# EAGLE design Beton Ajek NO AUTOROUTE (EAGLE 9.6.2)
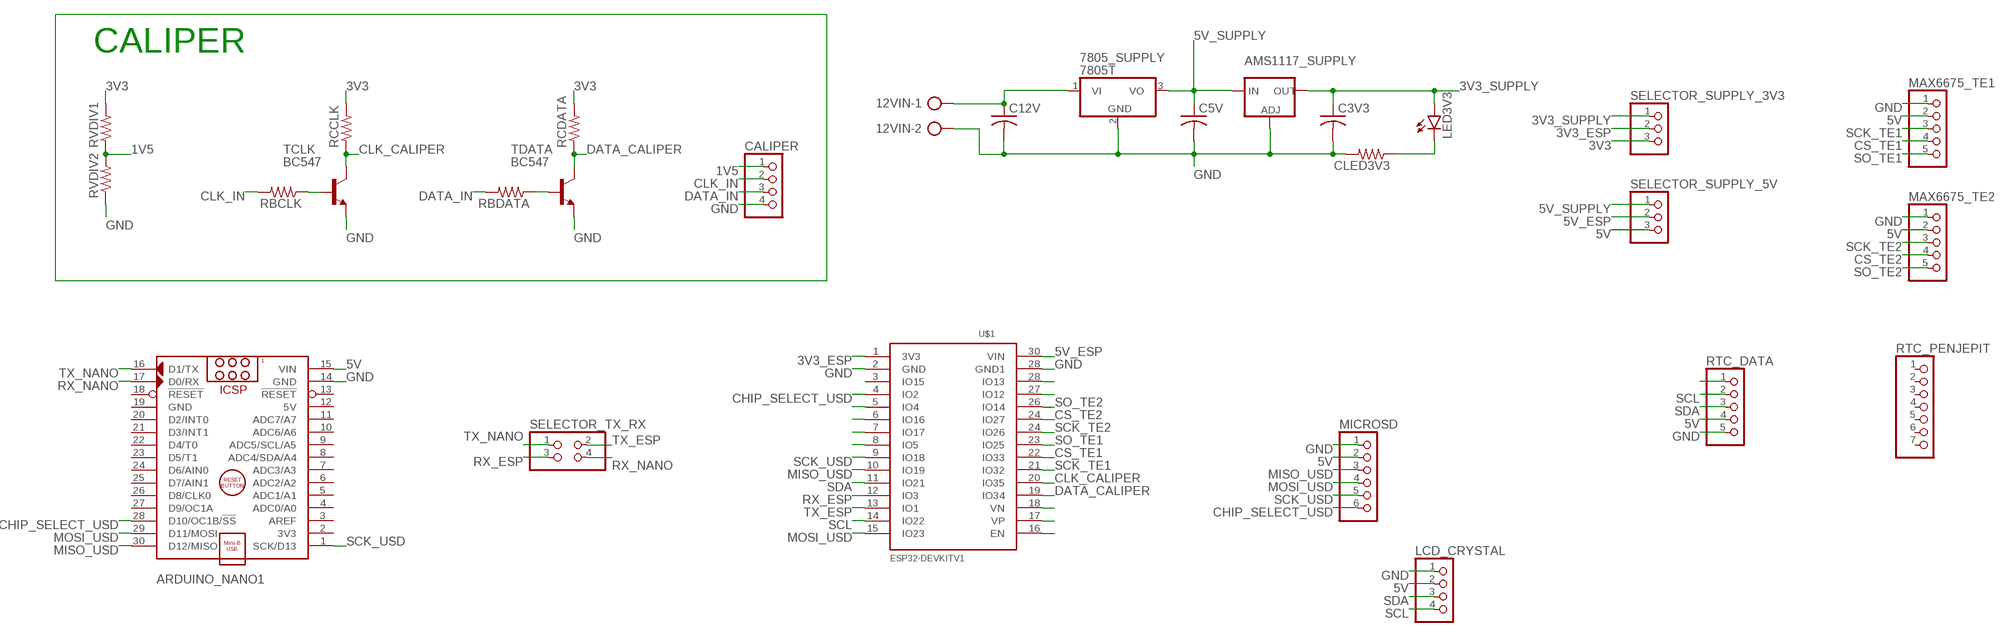
[diagram p0: schematic, sheet 1]

## Parts
12VIN  AK300/2  [AK300/2]
7805_SUPPLY  7805T  [TO220H]
AMS1117_SUPPLY  V_REG_LM1117SOT223  [SOT223]
ARDUINO_NANO1  ARDUINO_NANO  [ARDUINO_NANO]
C3V3  C-US075-032X103  [C075-032X103]
C5V  C-US075-032X103  [C075-032X103]
C12V  C-US075-032X103  [C075-032X103]
CALIPER  PINHD-1X4  [1X04]
CLED3V3  R-US_0207/10  [0207/10]
LCD_CRYSTAL  PINHD-1X4  [1X04]
LED3V3  LED5MM  [LED5MM]
MAX6675_TE1  PINHD-1X5  [1X05]
MAX6675_TE2  PINHD-1X5  [1X05]
MICROSD  PINHD-1X6  [1X06]
RBCLK  R-US_0207/10  [0207/10]
RBDATA  R-US_0207/10  [0207/10]
RCCLK  R-US_0207/10  [0207/10]
RCDATA  R-US_0207/10  [0207/10]
RTC_DATA  PINHD-1X5  [1X05]
RTC_PENJEPIT  PINHD-1X7  [1X07]
RVDIV1  R-US_0207/10  [0207/10]
RVDIV2  R-US_0207/10  [0207/10]
SELECTOR_SUPPLY_3V3  PINHD-1X3  [1X03]
SELECTOR_SUPPLY_5V  PINHD-1X3  [1X03]
SELECTOR_TX_RX  PINHD-2X2  [2X02]
TCLK  BC547  [TO92]
TDATA  BC547  [TO92]
U$1  ESP32DEVKITV1  [ESP32-DEVKITV1]

## Nets
1V5: CALIPER.1 RVDIV1.1 RVDIV2.2
3V3: RCCLK.2 RCDATA.2 RVDIV1.2 SELECTOR_SUPPLY_3V3.3
3V3_ESP: SELECTOR_SUPPLY_3V3.2 U$1.1(3V3)
3V3_SUPPLY: AMS1117_SUPPLY.2(OUT) AMS1117_SUPPLY.4(OUT) C3V3.1 LED3V3.A SELECTOR_SUPPLY_3V3.1
5V: ARDUINO_NANO1.15(VIN) LCD_CRYSTAL.2 MAX6675_TE1.2 MAX6675_TE2.2 MICROSD.2 RTC_DATA.4 SELECTOR_SUPPLY_5V.3
5V_ESP: SELECTOR_SUPPLY_5V.2 U$1.30(VIN)
5V_SUPPLY: 7805_SUPPLY.3(VO) AMS1117_SUPPLY.3(IN) C5V.1 SELECTOR_SUPPLY_5V.1
CHIP_SELECT_USD: ARDUINO_NANO1.28(D10/OC1B/!SS) MICROSD.6 U$1.4(IO2)
CLK_CALIPER: RCCLK.1 TCLK.3(C) U$1.20(IO35)
CLK_IN: CALIPER.2 RBCLK.2
CS_TE1: MAX6675_TE1.4 U$1.22(IO33)
CS_TE2: MAX6675_TE2.4 U$1.24(IO27)
DATA_CALIPER: RCDATA.1 TDATA.3(C) U$1.19(IO34)
DATA_IN: CALIPER.3 RBDATA.2
GND: 12VIN.2 7805_SUPPLY.2(GND) AMS1117_SUPPLY.1(ADJ) ARDUINO_NANO1.14(GND) C3V3.2 C5V.2 C12V.2 CALIPER.4 CLED3V3.2 LCD_CRYSTAL.1 MAX6675_TE1.1 MAX6675_TE2.1 MICROSD.1 RTC_DATA.5 RVDIV2.1 TCLK.1(E) TDATA.1(E) U$1.2(GND) U$1.28(GND1)
MISO_USD: ARDUINO_NANO1.30(D12/MISO) MICROSD.3 U$1.10(IO19)
MOSI_USD: ARDUINO_NANO1.29(D11/MOSI) MICROSD.4 U$1.15(IO23)
N$1: 12VIN.1 7805_SUPPLY.1(VI) C12V.1
N$2: RBCLK.1 TCLK.2(B)
N$4: U$1.28(IO13)
N$5: U$1.27(IO12)
N$6: U$1.5(IO4)
N$13: CLED3V3.1 LED3V3.K(C)
N$14: U$1.18(VN)
N$15: U$1.17(VP)
N$16: U$1.16(EN)
N$18: RBDATA.1 TDATA.2(B)
N$22: U$1.6(IO16)
N$23: U$1.7(IO17)
N$24: U$1.8(IO5)
N$52: RTC_DATA.1
RX_ESP: SELECTOR_TX_RX.3 U$1.12(IO3)
RX_NANO: ARDUINO_NANO1.17(D0/RX) SELECTOR_TX_RX.4
SCK_TE1: MAX6675_TE1.3 U$1.21(IO32)
SCK_TE2: MAX6675_TE2.3 U$1.24(IO26)
SCK_USD: ARDUINO_NANO1.1(SCK/D13) MICROSD.5 U$1.9(IO18)
SCL: LCD_CRYSTAL.4 RTC_DATA.2 U$1.14(IO22)
SDA: LCD_CRYSTAL.3 RTC_DATA.3 U$1.11(IO21)
SO_TE1: MAX6675_TE1.5 U$1.23(IO25)
SO_TE2: MAX6675_TE2.5 U$1.26(IO14)
TX_ESP: SELECTOR_TX_RX.2 U$1.13(IO1)
TX_NANO: ARDUINO_NANO1.16(D1/TX) SELECTOR_TX_RX.1
Unconnected: ARDUINO_NANO1.2(3V3) ARDUINO_NANO1.3(AREF) ARDUINO_NANO1.4(ADC0/A0) ARDUINO_NANO1.5(ADC1/A1) ARDUINO_NANO1.6(ADC2/A2) ARDUINO_NANO1.7(ADC3/A3) ARDUINO_NANO1.8(ADC4/SDA/A4) ARDUINO_NANO1.9(ADC5/SCL/A5) ARDUINO_NANO1.10(ADC6/A6) ARDUINO_NANO1.11(ADC7/A7) ARDUINO_NANO1.13(!RESET) ARDUINO_NANO1.18(!RESET) ARDUINO_NANO1.20(D2/INT0) ARDUINO_NANO1.21(D3/INT1) ARDUINO_NANO1.22(D4/T0) ARDUINO_NANO1.23(D5/T1) ARDUINO_NANO1.24(D6/AIN0) ARDUINO_NANO1.25(D7/AIN1) ARDUINO_NANO1.26(D8/CLK0) ARDUINO_NANO1.27(D9/OC1A) RTC_PENJEPIT.1 RTC_PENJEPIT.2 RTC_PENJEPIT.3 RTC_PENJEPIT.4 RTC_PENJEPIT.5 RTC_PENJEPIT.6 RTC_PENJEPIT.7 U$1.3(IO15)

## Notes on the sheet
- CALIPER

## Power pins joined to a net without a drawn wire
5V: ARDUINO_NANO1.12(5V)
GND: ARDUINO_NANO1.19(GND)

## Library data of the parts
12VIN = con-ptr500:AK300/2: CONNECTOR
7805_SUPPLY = adafruit:78*: Positive VOLTAGE REGULATOR Added bigger pads to the TO-92 package
AMS1117_SUPPLY = SparkFun-IC-Power:V_REG_LM1117: Voltage Regulator LM1117 Standard adjustable voltage regulator but in SMD form. Spark Fun Electronics SKU : COM-00595; PROD_ID: VREG-08170
ARDUINO_NANO1 = ArduinoNanoV30:ARDUINO_NANO: Arduino Nano V3.0 Module Overview: The Arduino Nano is a small, complete, and breadboard-friendly board based on the ATmega328 (Arduino Nano 3.x) or ATmega168 (Arduino Nano 2.x). It has more or less the same functionality of the Arduino Duemilanove, but in a different package. It lacks only a DC power jack, and works with a Mini-B USB cable instead of a standard one. The Nano was designed and is being produced by Gravitech <http://www.gravitech.us/arna30wiatp.html>. General specifications: Item Value Microcontroller Atmel ATmega168 or ATmega328 Operating Voltage (logic level) 5 V Input Voltage (recommended) 7-12 V Input Voltage (limits) 6-20 V Digital I/O Pins 14 (of which 6 provide PWM output) Analog Input Pins 8 DC Current per I/O Pin 40 mA Flash Memory 16 KB (ATmega168) or 32 KB (ATmega328) of which 2 KB used by bootloader SRAM 1 KB (ATmega168) or 2 KB (ATmega328) EEPROM 512 bytes (ATmega168) or 1 KB (ATmega328) Clock Speed 16 MHz Dimensions (Inches) 0.73" x 1.70" Dimensions (mm) 18mm x 45mm Overall height About 9 mm (not including pins) Weigth 5 g Power: The Arduino Nano can be powered via the Mini-B USB connection, 6-20V unregulated external power supply (pin 30), or 5V regulated external power supply (pin 27). The power source is automatically selected to the highest voltage source. Memory: The ATmega168 has 16 KB of flash memory for storing code (of which 2 KB is used for the bootloader); the ATmega328 has 32 KB, (also with 2 KB used for the bootloader). The ATmega168 has 1 KB of SRAM and 512 bytes of EEPROM (which can be read and written with the EEPROM library); the ATmega328 has 2 KB of SRAM and 1 KB of EEPROM. Input and Output: Each of the 14 digital pins on the Nano can be used as an input or output, using pinMode(), digitalWrite(), and digitalRead() functions. They operate at 5 volts. Each pin can provide or receive a maximum of 40 mA and has an internal pull-up resistor (disconnected by default) of 20-50 kOhms. In addition, some pins have specialized functions. Visit Arduino - ArduinoBoardNano <https://www.arduino.cc/en/Main/ArduinoBoardNano>
C3V3 C5V C12V = rcl:C-US: CAPACITOR, American symbol; SPICEPREFIX: C
CALIPER LCD_CRYSTAL = pinhead:PINHD-1X4: PIN HEADER
CLED3V3 RBCLK RBDATA RCCLK RCDATA RVDIV1 RVDIV2 = rcl:R-US_: RESISTOR, American symbol; SPICEPREFIX: R
LED3V3 = led:LED: LED OSRAM: - CHIPLED LG R971, LG N971, LY N971, LG Q971, LY Q971, LO R971, LY R971 LH N974, LH R974 LS Q976, LO Q976, LY Q976 LO Q996 - Hyper CHIPLED LW Q18S LB Q993, LB Q99A, LB R99A - SideLED LS A670, LO A670, LY A670, LG A670, LP A670 LB A673, LV A673, LT A673, LW A673 LH A674 LY A675 LS A676, LA A676, LO A676, LY A676, LW A676 LS A679, LY A679, LG A679 - Hyper Micro SIDELED® LS Y876, LA Y876, LO Y876, LY Y876 LT Y87S - SmartLED LW L88C, LW L88S LB L89C, LB L89S, LG L890 LS L89K, LO L89K, LY L89K LS L896, LA L896, LO L896, LY L896 - TOPLED LS T670, LO T670, LY T670, LG T670, LP T670 LSG T670, LSP T670, LSY T670, LOP T670, LYG T670 LG T671, LOG T671, LSG T671 LB T673, LV T673, LT T673, LW T673 LH T674 LS T676, LA T676, LO T676, LY T676, LB T676, LH T676, LSB T676, LW T676 LB T67C, LV T67C, LT T67C, LS T67K, LO T67K, LY T67K, LW E67C LS E67B, LA E67B, LO E67B, LY E67B, LB E67C, LV E67C, LT E67C LW T67C LS T679, LY T679, LG T679 LS T770, LO T770, LY T770, LG T770, LP T770 LB T773, LV T773, LT T773, LW T773 LH T774 LS E675, LA E675, LY E675, LS T675 LS T776, LA T776, LO T776, LY T776, LB T776 LHGB T686 LT T68C, LB T68C - Hyper Mini TOPLED® LB M676 - Mini TOPLED Santana® LG M470 LS M47K, LO M47K, LY M47K Source: http://www.osram.convergy.de LUXEON: - LUMILED® LXK2-PW12-R00, LXK2-PW12-S00, LXK2-PW14-U00, LXK2-PW14-V00 LXK2-PM12-R00, LXK2-PM12-S00, LXK2-PM14-U00 LXK2-PE12-Q00, LXK2-PE12-R00, LXK2-PE12-S00, LXK2-PE14-T00, LXK2-PE14-U00 LXK2-PB12-K00, LXK2-PB12-L00, LXK2-PB12-M00, LXK2-PB14-N00, LXK2-PB14-P00, LXK2-PB14-Q00 LXK2-PR12-L00, LXK2-PR12-M00, LXK2-PR14-Q00, LXK2-PR14-R00 LXK2-PD12-Q00, LXK2-PD12-R00, LXK2-PD12-S00 LXK2-PH12-R00, LXK2-PH12-S00 LXK2-PL12-P00, LXK2-PL12-Q00, LXK2-PL12-R00 Source: www.luxeon.com KINGBRIGHT: KA-3528ASYC Source: www.kingbright.com
MAX6675_TE1 MAX6675_TE2 RTC_DATA = pinhead:PINHD-1X5: PIN HEADER
MICROSD = pinhead:PINHD-1X6: PIN HEADER
RTC_PENJEPIT = pinhead:PINHD-1X7: PIN HEADER
SELECTOR_SUPPLY_3V3 SELECTOR_SUPPLY_5V = pinhead:PINHD-1X3: PIN HEADER
SELECTOR_TX_RX = pinhead:PINHD-2X2: PIN HEADER
TCLK TDATA = transistor:BC547: NPN TRANSISTOR
U$1 = ESP32-DEVKITV1:ESP32DEVKITV1

## Board
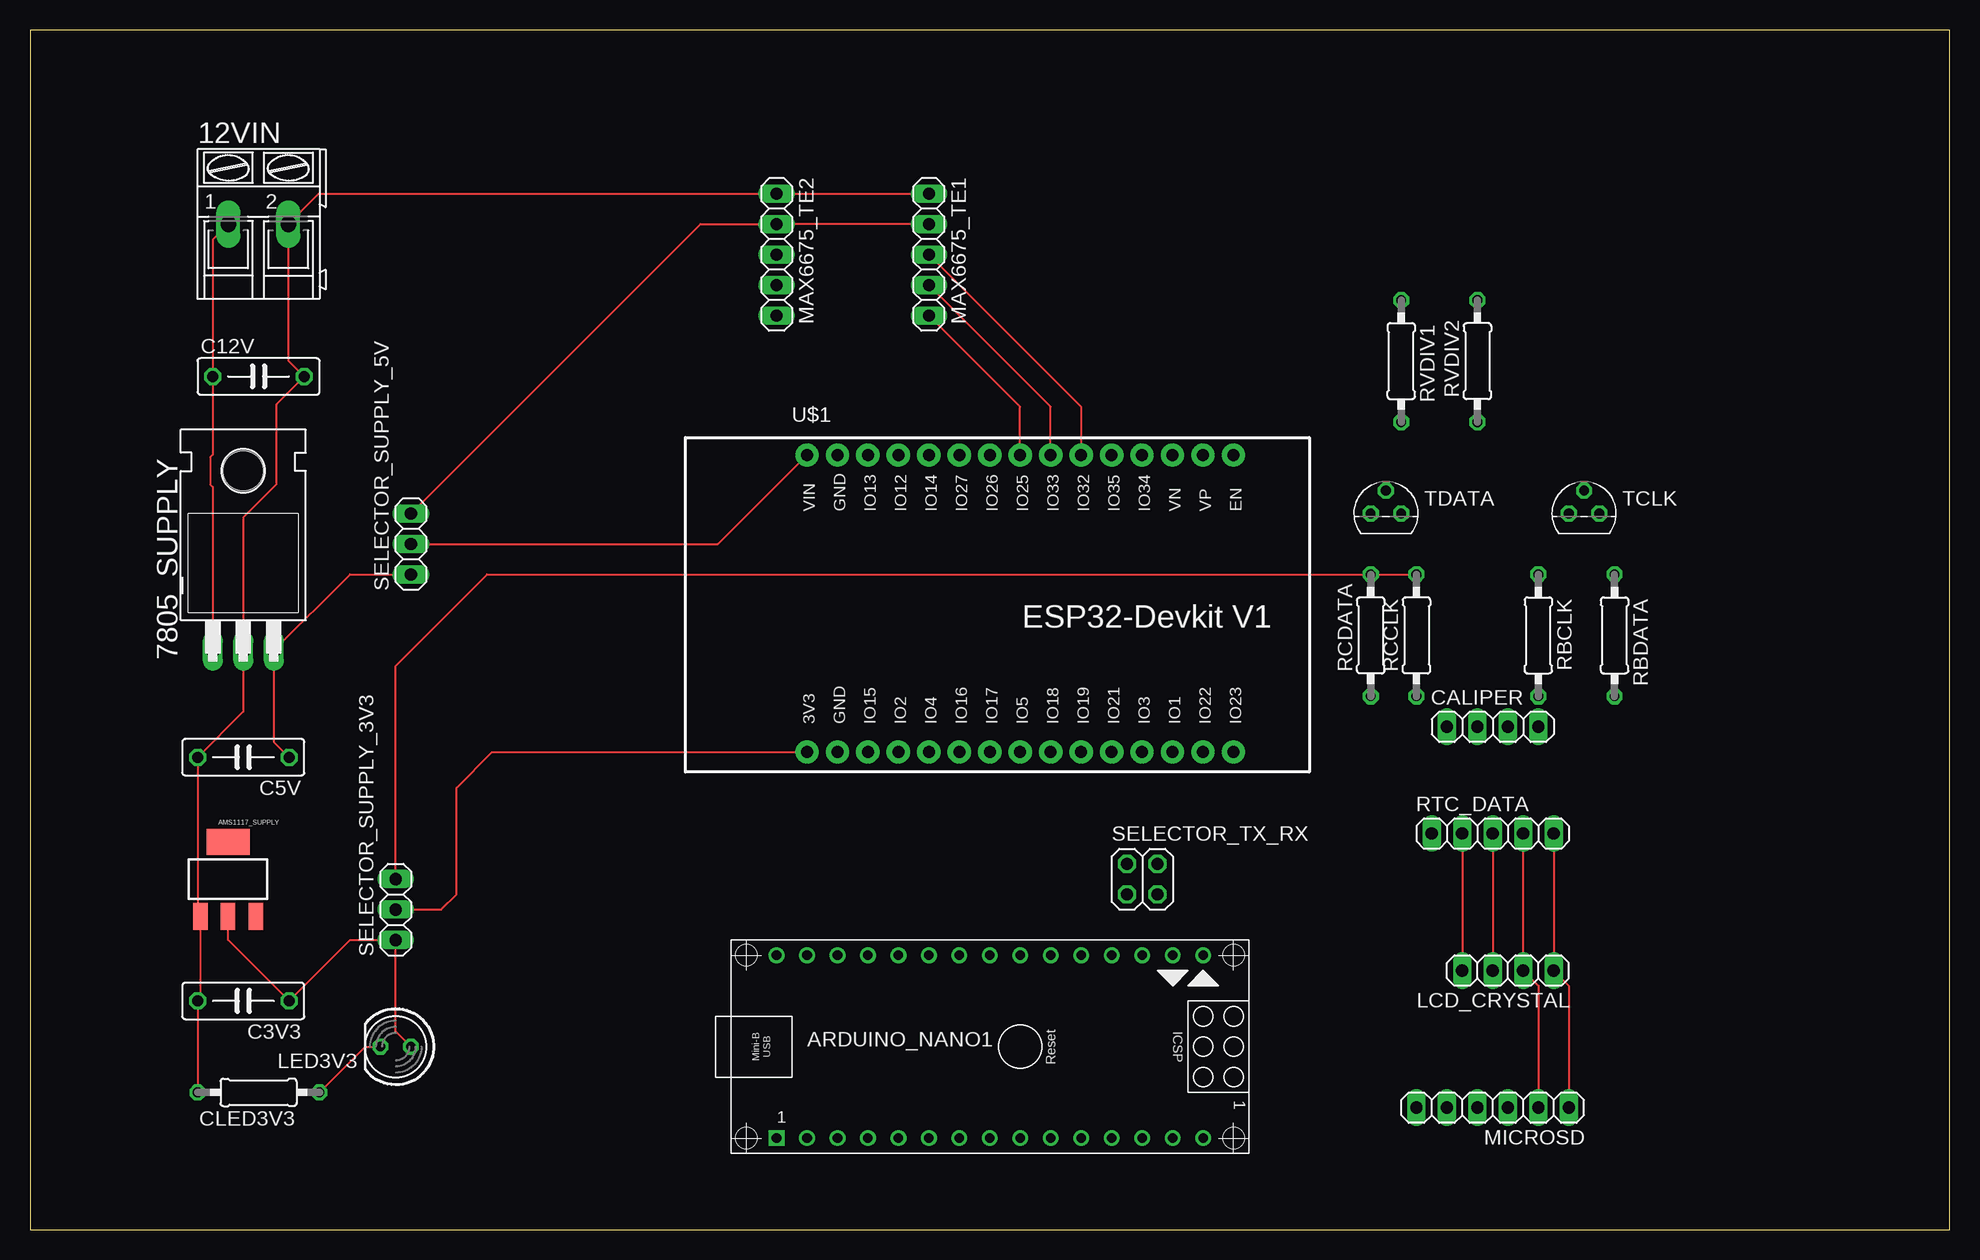
[diagram p1: board, top side]

Size 160 x 100 mm. Coordinates in mm from the lower left corner, seen from the top.
Outline: 0,0 160,0 160,100 0,100 0,0
Copper layers (1*16): Top 0.035mm / dielectric 1.5mm / Bottom 0.035mm
Design rules "default": minimum track width 6mil, minimum drill 0.35mm, track to track 6mil, track to pad 6mil, pad to pad 6mil, via to via 6mil, smd to smd 6mil, copper to edge 40mil, drill to drill 6mil, minimum pad ring 10mil, minimum via ring 8mil, stop-mask expansion 4mil, vias tented up to drill 0mil, thermal gap 10mil

### Footprints (pad centres in the part's own frame; a part is rotated, then mirrored left to right if it is on the bottom)
AK300/2 = drill 1.321 long: 1 -2.515,0; 2 2.489,0
TO220H = drill 1.118 long: 1 -2.54,-10.16; 2 0,-10.16; 3 2.54,-10.16 | hole 3.302: 0,4.826
SOT223 = smd 1.219 x 2.235: 1 -2.311,-3.099; 2 0,-3.099; 3 2.311,-3.099 | smd 3.6 x 2.2: 4 0,3.099
ARDUINO_NANO = drill 0.8 square: 1 -20.32,-7.62 | drill 0.8: 2 -17.78,-7.62; 3 -15.24,-7.62; 4 -12.7,-7.62; 5 -10.16,-7.62; 6 -7.62,-7.62; 7 -5.08,-7.62; 8 -2.54,-7.62; 9 0,-7.62; 10 2.54,-7.62; 11 5.08,-7.62; 12 7.62,-7.62; 13 10.16,-7.62; 14 12.7,-7.62; 15 15.24,-7.62; 16 15.24,7.62; 17 12.7,7.62; 18 10.16,7.62; 19 7.62,7.62; 20 5.08,7.62; 21 2.54,7.62; 22 0,7.62; 23 -2.54,7.62; 24 -5.08,7.62; 25 -7.62,7.62; 26 -10.16,7.62; 27 -12.7,7.62; 28 -15.24,7.62; 29 -17.78,7.62; 30 -20.32,7.62 | hole 1.778: -22.86,-7.62; -22.86,7.62; 17.78,7.62; 17.78,-7.62
C075-032X103 = drill 0.914 octagon: 1 -3.81,0; 2 3.81,0
1X04 = drill 1.016 long: 1 -3.81,0; 2 -1.27,0; 3 1.27,0; 4 3.81,0
0207/10 = drill 0.813 octagon: 1 -5.08,0; 2 5.08,0
LED5MM = drill 0.813 octagon: A -1.27,0; K 1.27,0
1X05 = drill 1.016 long: 1 -5.08,0; 2 -2.54,0; 3 0,0; 4 2.54,0; 5 5.08,0
1X06 = drill 1.016 long: 1 -6.35,0; 2 -3.81,0; 3 -1.27,0; 4 1.27,0; 5 3.81,0; 6 6.35,0
1X07 = drill 1.016 long: 1 -7.62,0; 2 -5.08,0; 3 -2.54,0; 4 0,0; 5 2.54,0; 6 5.08,0; 7 7.62,0
1X03 = drill 1.016 long: 1 -2.54,0; 2 0,0; 3 2.54,0
2X02 = drill 1.016 octagon: 1 -1.27,-1.27; 2 -1.27,1.27; 3 1.27,-1.27; 4 1.27,1.27
TO92 = drill 0.813 octagon: 1 1.27,0; 2 0,1.905; 3 -1.27,0
ESP32-DEVKITV1 = drill 1 pad 1.93: 1 -22.87,-13.54; 2 -20.33,-13.54; 3 -17.79,-13.54; 4 -15.25,-13.54; 5 -12.71,-13.54; 6 -10.17,-13.54; 7 -7.63,-13.54; 8 -5.09,-13.54; 9 -2.55,-13.54; 10 -0.01,-13.54; 11 2.53,-13.54; 12 5.07,-13.54; 13 7.61,-13.54; 14 10.15,-13.54; 15 12.69,-13.54; 16 12.69,11.23; 17 10.15,11.23; 18 7.61,11.23; 19 5.07,11.23; 20 2.53,11.23; 21 -0.01,11.23; 22 -2.55,11.23; 23 -5.09,11.23; 24 -7.63,11.23; 25 -10.17,11.23; 26 -12.71,11.23; 27 -15.25,11.23; 28 -17.79,11.23; 29 -20.33,11.23; 30 -22.87,11.23

### Placement (x,y rotation side)
12VIN  19.05,83.82 0 top
7805_SUPPLY  17.78,58.42 0 top
AMS1117_SUPPLY  16.51,29.21 0 top
ARDUINO_NANO1  82.55,15.24 0 top
C3V3  17.78,19.05 180 top
C5V  17.78,39.37 180 top
C12V  19.05,71.12 0 top
CALIPER  121.92,41.91 0 top
CLED3V3  19.05,11.43 180 top
LCD_CRYSTAL  123.19,21.59 180 top
LED3V3  30.48,15.24 180 top
MAX6675_TE1  74.93,81.28 270 top
MAX6675_TE2  62.23,81.28 270 top
MICROSD  121.92,10.16 180 top
RBCLK  125.73,49.53 270 top
RBDATA  132.08,49.53 270 top
RCCLK  115.57,49.53 90 top
RCDATA  111.76,49.53 90 top
RTC_DATA  121.92,33.02 0 top
RTC_PENJEPIT  -31.75,85.09 0 top  (outside the outline)
RVDIV1  114.3,72.39 270 top
RVDIV2  120.65,72.39 90 top
SELECTOR_SUPPLY_3V3  30.48,26.67 90 top
SELECTOR_SUPPLY_5V  31.75,57.15 90 top
SELECTOR_TX_RX  92.71,29.21 0 top
TCLK  129.54,59.69 0 top
TDATA  113.03,59.69 0 top
U$1  87.63,53.34 0 top

### Tracks (layer width: path | path; a pad name or v marks a point on that pad's centre or on a via)
3V3
  Top 0.152: SELECTOR_SUPPLY_3V3.3 30.48,46.99 38.1,54.61 RCDATA.2 RCCLK.2
3V3_ESP
  Top 0.152: SELECTOR_SUPPLY_3V3.2 34.29,26.67 35.56,27.94 35.56,36.83 38.53,39.8 U$1.1
3V3_SUPPLY
  Top 0.152: AMS1117_SUPPLY.2 16.51,24.13 C3V3.1 26.67,24.13 SELECTOR_SUPPLY_3V3.1 30.48,16.51 LED3V3.A
5V
  Top 0.152: SELECTOR_SUPPLY_5V.3 55.88,83.82 MAX6675_TE2.2 MAX6675_TE1.2 | MICROSD.2 125.73,20.32 LCD_CRYSTAL.2 RTC_DATA.4
5V_ESP
  Top 0.152: SELECTOR_SUPPLY_5V.2 57.34,57.15 U$1.30
5V_SUPPLY
  Top 0.152: C5V.1 20.32,40.64 7805_SUPPLY.3 26.67,54.61 30.48,54.61
CS_TE1
  Top 0.152: U$1.22 85.08,68.57 85.09,68.58 MAX6675_TE1.4
GND
  Top 0.152: CLED3V3.2 C3V3.2 14.2,19.28 AMS1117_SUPPLY.1 13.97,26.34 C5V.2 17.78,43.18 7805_SUPPLY.2 17.78,59.37 20.52,62.11 20.52,68.78 C12V.2 21.54,72.44 12VIN.2 24.08,86.36 MAX6675_TE2.1 MAX6675_TE1.1 | RTC_DATA.5 LCD_CRYSTAL.1 128.27,20.32 MICROSD.1
N$1
  Top 0.152: 12VIN.1 15.24,82.53 C12V.1 15.24,64.58 15.04,64.38 15.04,62.11 15.24,61.91 15.24,49.53
N$13
  Top 0.152: CLED3V3.1 27.94,15.24 LED3V3.K
SCK_TE1
  Top 0.152: MAX6675_TE1.3 87.62,68.59 U$1.21
SCL
  Top 0.152: RTC_DATA.2 119.38,20.32
SDA
  Top 0.152: RTC_DATA.3 LCD_CRYSTAL.3
SO_TE1
  Top 0.152: U$1.23 82.54,68.57 82.55,68.58 MAX6675_TE1.5